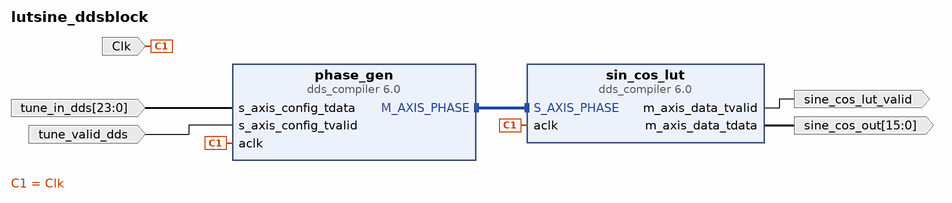
[diagram p0: block diagram of the top level]
# Vivado block design lutsine_ddsblock, xc7s50csga324-1, Vivado 2022.2
create_bd_design lutsine_ddsblock

create_bd_port -dir I tune_valid_dds
create_bd_port -dir O -from 15 -to 0 sine_cos_out
create_bd_port -dir O sine_cos_lut_valid
create_bd_port -dir I Clk
create_bd_port -dir I -from 23 -to 0 tune_in_dds

create_bd_cell -type ip -vlnv xilinx.com:ip:dds_compiler:6.0 phase_gen
set_property -dict [list \
  CONFIG.DATA_Has_TLAST Not_Required \
  CONFIG.DDS_Clock_Rate 0.0441 \
  CONFIG.Latency 1 \
  CONFIG.M_DATA_Has_TUSER Not_Required \
  CONFIG.Noise_Shaping None \
  CONFIG.Output_Frequency1 0 \
  CONFIG.Output_Width 3 \
  CONFIG.Parameter_Entry Hardware_Parameters \
  CONFIG.PartsPresent Phase_Generator_only \
  CONFIG.Phase_Increment Programmable \
  CONFIG.Phase_Width 22 \
  CONFIG.S_PHASE_Has_TUSER Not_Required \
] [get_bd_cells phase_gen]
create_bd_cell -type ip -vlnv xilinx.com:ip:dds_compiler:6.0 sin_cos_lut
set_property -dict [list \
  CONFIG.Amplitude_Mode Full_Range \
  CONFIG.DATA_Has_TLAST Not_Required \
  CONFIG.Has_Phase_Out false \
  CONFIG.Latency 7 \
  CONFIG.M_DATA_Has_TUSER Not_Required \
  CONFIG.Noise_Shaping Taylor_Series_Corrected \
  CONFIG.Output_Frequency1 0 \
  CONFIG.Output_Selection Sine \
  CONFIG.Output_Width 16 \
  CONFIG.PINC1 0 \
  CONFIG.Parameter_Entry Hardware_Parameters \
  CONFIG.PartsPresent SIN_COS_LUT_only \
  CONFIG.Phase_Width 22 \
  CONFIG.S_PHASE_Has_TUSER Not_Required \
] [get_bd_cells sin_cos_lut]

# ---- connections ----

connect_bd_intf_net [get_bd_intf_pins sin_cos_lut/S_AXIS_PHASE] [get_bd_intf_pins phase_gen/M_AXIS_PHASE]
connect_bd_net [get_bd_ports Clk] [get_bd_pins phase_gen/aclk] [get_bd_pins sin_cos_lut/aclk]
connect_bd_net -net s_axis_config_tdata_0_1 [get_bd_ports tune_in_dds] [get_bd_pins phase_gen/s_axis_config_tdata]
connect_bd_net -net s_axis_config_tvalid_0_1 [get_bd_ports tune_valid_dds] [get_bd_pins phase_gen/s_axis_config_tvalid]
connect_bd_net [get_bd_pins sin_cos_lut/m_axis_data_tdata] [get_bd_ports sine_cos_out]
connect_bd_net [get_bd_pins sin_cos_lut/m_axis_data_tvalid] [get_bd_ports sine_cos_lut_valid]

validate_bd_design
save_bd_design
